# EAGLE design board1 (EAGLE 9.6.2)
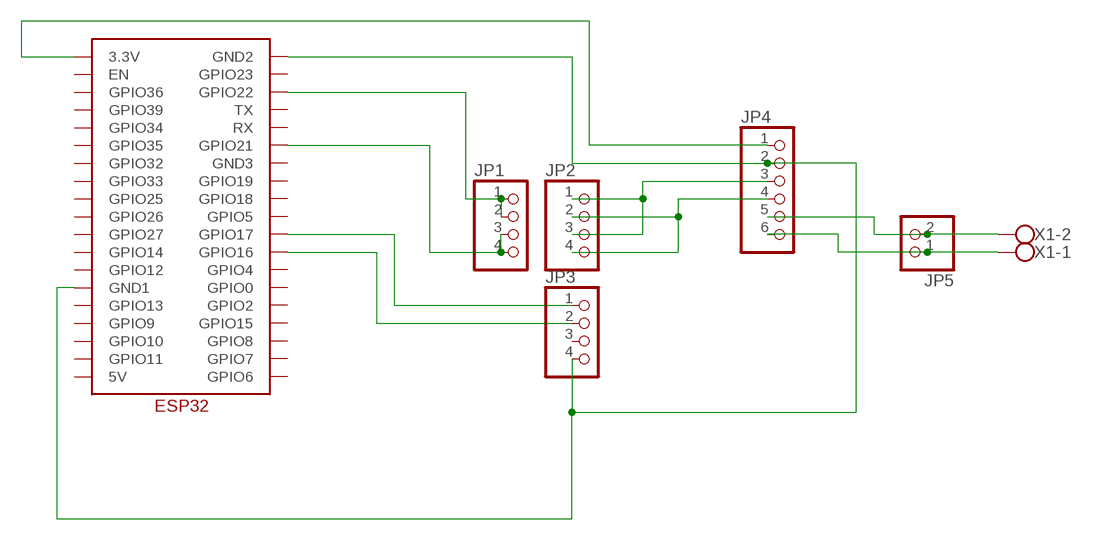
[diagram p0: schematic, sheet 1]

## Parts
JP1  PINHD-1X4  [1X04]
JP2  PINHD-1X4  [1X04]
JP3  PINHD-1X4  [1X04]
JP4  PINHD-1X6  [1X06]
JP5  PINHD-1X2  [1X02]
U$1  ESP32_GRBL  [ESP32_GRBL]
X1  W237-102  [W237-102]

## Nets
N$1: JP3.4 JP4.2 U$1.GND1 U$1.GND2
N$2: JP4.1 U$1.3.3V
N$3: JP1.1 JP1.2 U$1.GPIO22
N$4: JP1.3 JP1.4 U$1.GPIO21
N$5: JP2.1 JP2.3 JP4.3
N$6: JP4.5 JP5.2 X1.2
N$7: JP2.2 JP2.4 JP4.4
N$8: JP3.1 U$1.GPIO17
N$9: JP3.2 U$1.GPIO16
N$10: JP4.6 JP5.1 X1.1
Unconnected: JP3.3 U$1.5V U$1.EN U$1.GND3 U$1.GPIO0 U$1.GPIO2 U$1.GPIO4 U$1.GPIO5 U$1.GPIO6 U$1.GPIO7 U$1.GPIO8 U$1.GPIO9 U$1.GPIO10 U$1.GPIO11 U$1.GPIO12 U$1.GPIO13 U$1.GPIO14 U$1.GPIO15 U$1.GPIO18 U$1.GPIO19 U$1.GPIO23 U$1.GPIO25 U$1.GPIO26 U$1.GPIO27 U$1.GPIO32 U$1.GPIO33 U$1.GPIO34 U$1.GPIO35 U$1.GPIO36 U$1.GPIO39 U$1.RX U$1.TX

## Library data of the parts
JP1-JP3 = pinhead:PINHD-1X4: PIN HEADER
JP4 = pinhead:PINHD-1X6: PIN HEADER
JP5 = pinhead:PINHD-1X2: PIN HEADER
U$1 = ESP32:ESP32_GRBL
X1 = con-wago-500:W237-102: WAGO SCREW CLAMP; MPN: 237-102; OC_FARNELL: unknown; OC_NEWARK: 70K9898

## Board
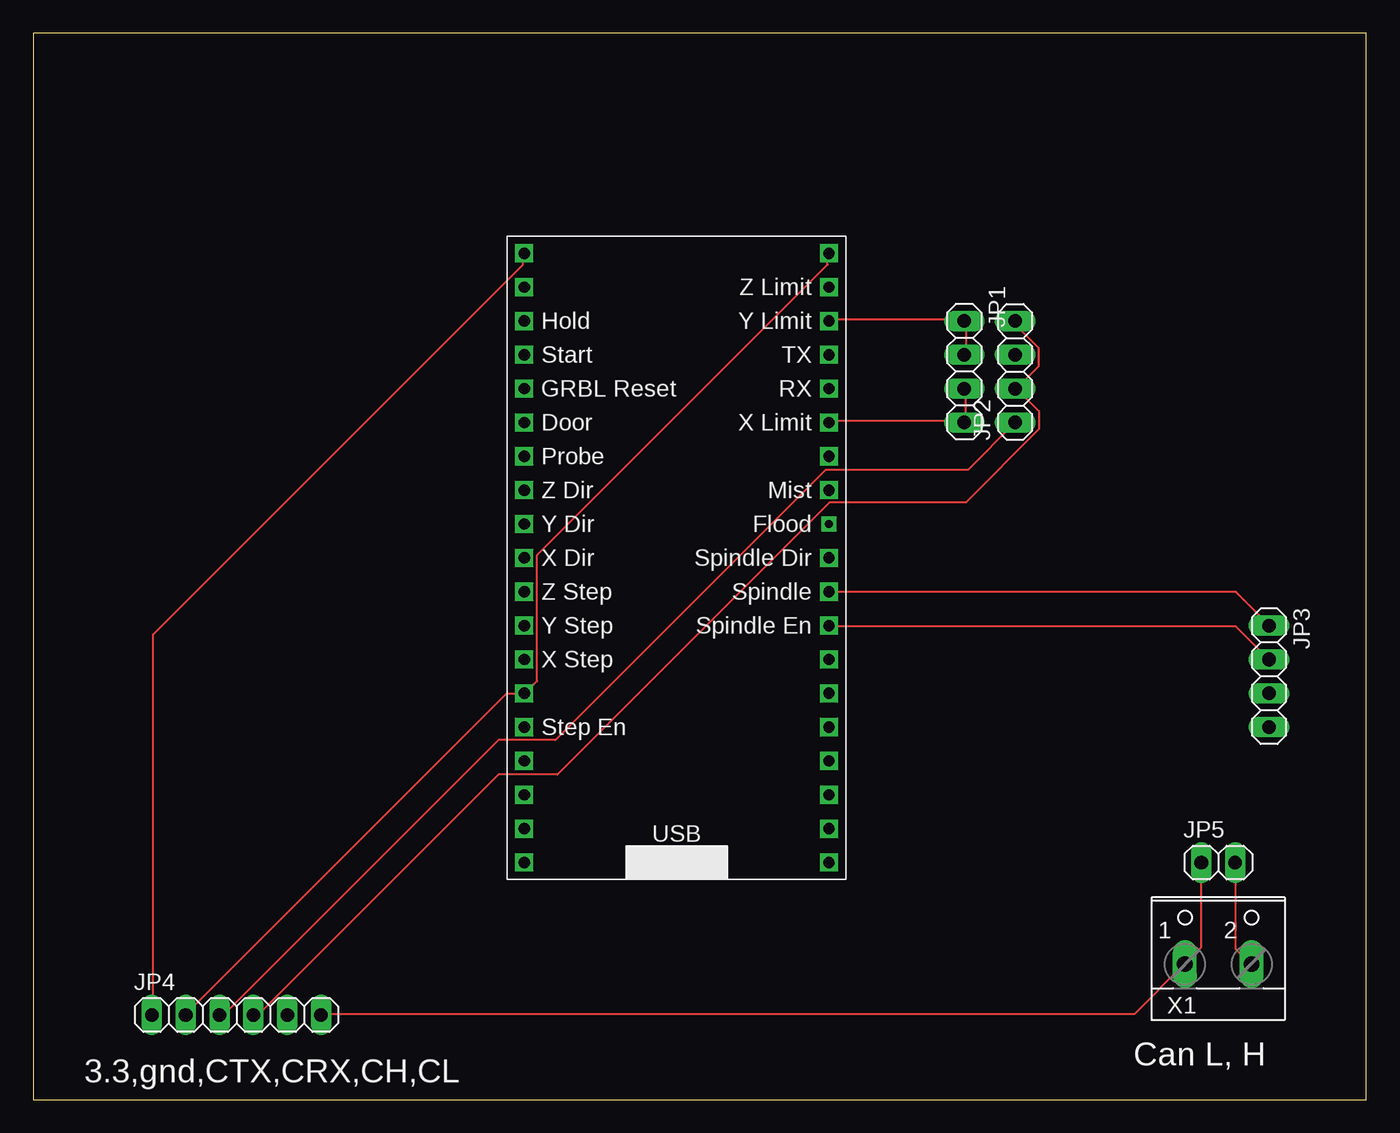
[diagram p1: board, top side]
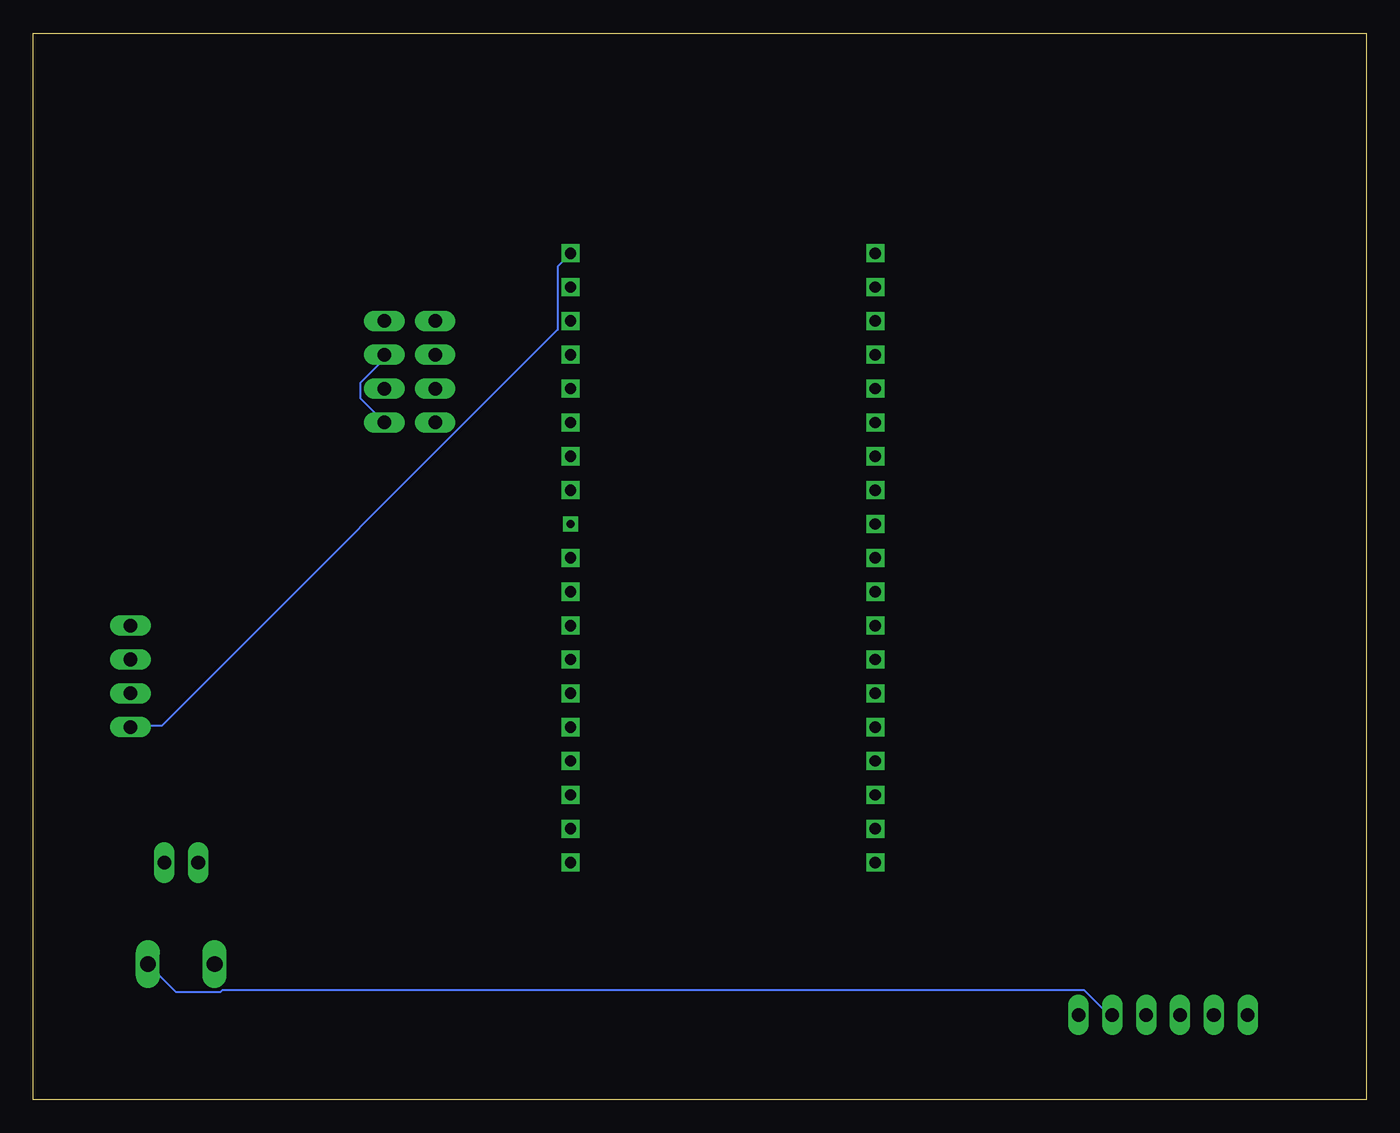
[diagram p2: board, bottom side, seen from below]

Size 100 x 80 mm. Coordinates in mm from the lower left corner, seen from the top.
Outline: 0,0 100,0 100,80 0,80 0,0
Copper layers (1*16): Top 0.035mm / dielectric 1.5mm / Bottom 0.035mm
Design rules "default": minimum track width 6mil, minimum drill 0.35mm, track to track 6mil, track to pad 6mil, pad to pad 6mil, via to via 6mil, smd to smd 6mil, copper to edge 40mil, drill to drill 6mil, minimum pad ring 10mil, minimum via ring 8mil, stop-mask expansion 4mil, vias tented up to drill 0mil, thermal gap 10mil

### Footprints (pad centres in the part's own frame; a part is rotated, then mirrored left to right if it is on the bottom)
1X04 = drill 1.016 long: 1 -3.81,0; 2 -1.27,0; 3 1.27,0; 4 3.81,0
1X06 = drill 1.016 long: 1 -6.35,0; 2 -3.81,0; 3 -1.27,0; 4 1.27,0; 5 3.81,0; 6 6.35,0
1X02 = drill 1.016 long: 1 -1.27,0; 2 1.27,0
ESP32_GRBL = drill 0.85 square: 3.3V 1.27,46.99; 5V 1.27,1.27; EN 1.27,44.45; GND1 1.27,13.97; GND2 24.13,46.99; GND3 24.13,31.75; GPIO0 24.13,13.97; GPIO2 24.13,11.43; GPIO4 24.13,16.51; GPIO5 24.13,24.13; GPIO6 24.13,1.27; GPIO7 24.13,3.81; GPIO8 24.13,6.35; GPIO9 1.27,8.89; GPIO10 1.27,6.35; GPIO11 1.27,3.81; GPIO12 1.27,16.51; GPIO13 1.27,11.43; GPIO14 1.27,19.05; GPIO15 24.13,8.89; GPIO16 24.13,19.05; GPIO17 24.13,21.59; GPIO19 24.13,29.21; GPIO21 24.13,34.29; GPIO22 24.13,41.91; GPIO23 24.13,44.45; GPIO25 1.27,26.67; GPIO26 1.27,24.13; GPIO27 1.27,21.59; GPIO32 1.27,31.75; GPIO33 1.27,29.21; GPIO34 1.27,36.83; GPIO35 1.27,34.29; GPIO36 1.27,41.91; GPIO39 1.27,39.37; RX 24.13,36.83; TX 24.13,39.37 | drill 0.6 square: GPIO18 24.13,26.67
W237-102 = drill 1.194 long: 1 -2.5,-1.27; 2 2.5,-1.27

### Placement (x,y rotation side)
JP1  69.85,54.61 270 top
JP2  73.66,54.61 90 top
JP3  92.71,31.75 270 top
JP4  15.24,6.35 0 top
JP5  88.9,17.78 0 top
U$1  35.56,16.51 0 top
X1  88.9,11.43 0 top

### Tracks (layer width: path | path; a pad name or v marks a point on that pad's centre or on a via)
N$1
  Top 0.152: JP4.2 11.43,6.4 35.51,30.48 U$1.GND1 36.88,30.48 37.8,31.39 37.8,40.84 59.59,62.64 59.59,63.4 U$1.GND2
  Bottom 0.152: JP3.4 92.66,28.04 90.37,28.04 60.66,57.76 60.66,62.48 59.74,63.4 U$1.GND2
N$2
  Top 0.152: U$1.3.3V 36.73,63.4 36.73,62.64 8.99,34.9 8.99,6.4 JP4.1
N$3
  Top 0.152: U$1.GPIO22 59.74,58.52 69.8,58.52 JP1.1 69.95,58.37 69.95,55.93 JP1.2
N$4
  Top 0.152: U$1.GPIO21 59.74,50.9 69.8,50.9 JP1.4 69.95,50.9 69.95,53.34 JP1.3
N$5
  Top 0.152: JP2.1 70.1,47.24 59.44,47.24 39.17,26.98 34.9,26.98 14.33,6.4 14.02,6.4 JP4.3
  Bottom 0.152: JP2.1 75.44,52.58 75.44,53.8 73.76,55.47 73.76,55.78 JP2.3
N$6
  Top 0.152: JP5.2 90.22,17.68 90.22,11.28 91.29,10.21 X1.2
  Bottom 0.152: JP4.5 19.05,6.4 19.36,6.4 21.18,8.23 85.8,8.23 85.95,8.08 89.31,8.08 91.29,10.06 X1.2
N$7
  Top 0.152: 73.76,53.34 75.44,51.66 75.44,50.29 69.95,44.81 59.74,44.81 39.32,24.38 34.9,24.38 16.92,6.4 16.61,6.4 JP4.4 | 73.76,53.34 75.44,55.02 75.44,56.39 73.76,58.06 73.76,58.37 JP2.4 | 73.76,53.34 JP2.2
N$8
  Top 0.152: U$1.GPIO17 90.22,38.1 92.66,35.66 JP3.1
N$9
  Top 0.152: JP3.2 90.22,35.51 59.74,35.51 U$1.GPIO16
N$10
  Top 0.152: JP4.6 21.64,6.4 82.6,6.4 86.26,10.06 X1.1 86.41,10.21 87.63,11.43 JP5.1

### Text on the board
tNames: Can L, H | 3.3,gnd,CTX,CRX,CH,CL